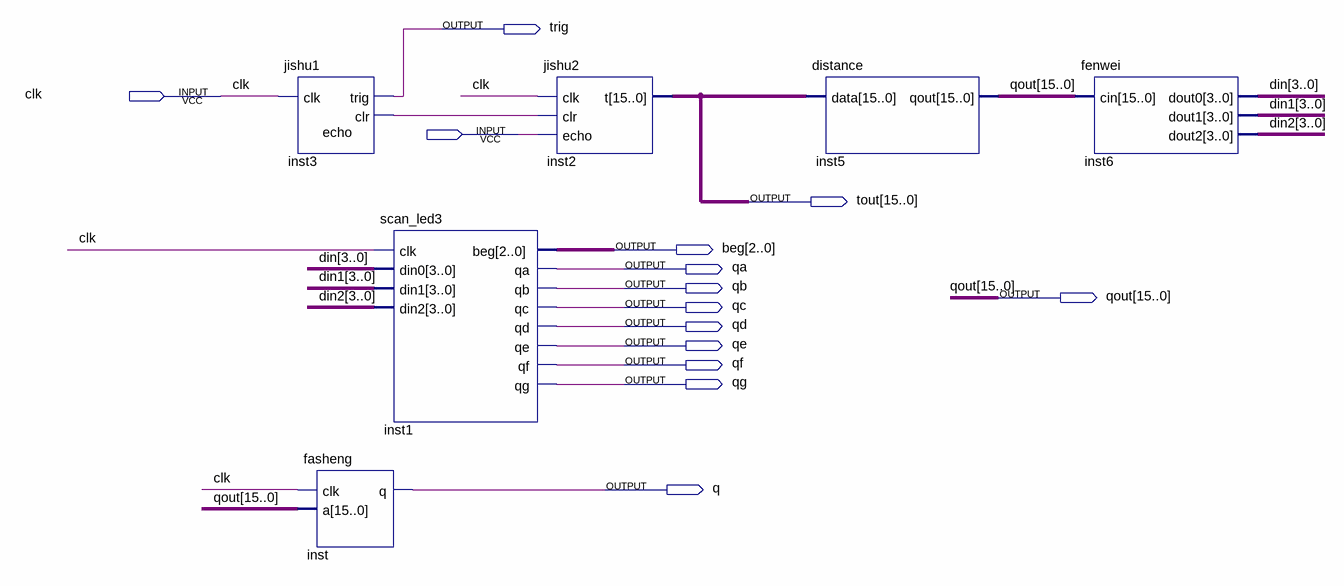
[diagram p0: schematic sheet]
// Quartus schematic final.bdf as structural Verilog: 6 symbols, 14 pins
module \final  (
  input  clk,
  input  echo,
  output trig,
  output [15:0] tout,
  output [2:0] beg,
  output qa,
  output qb,
  output [15:0] qout,
  output qc,
  output qd,
  output qe,
  output qf,
  output qg,
  output q
);

  wire inst3_clr;
  wire [3:0] din, din1, din2;

  jishu1 inst3 (.clk(clk), .trig(trig), .clr(inst3_clr));
  fasheng inst (.clk(clk), .a(qout), .q(q));
  scan_led3 inst1 (
    .clk(clk), .din0(din), .din1(din1), .din2(din2), .beg(beg), .qa(qa), .qb(qb), .qc(qc), .qd(qd), .qe(qe),
    .qf(qf), .qg(qg));
  jishu2 inst2 (.clk(clk), .clr(inst3_clr), .echo(echo), .t(tout));
  distance inst5 (.data(tout), .qout(qout));
  fenwei inst6 (.cin(qout), .dout0(din), .dout1(din1), .dout2(din2));
endmodule
